# Altium schematic sheet [06] - CPU - HDMI, LVDS.SchDoc
size A2; DocumentNumber: 6; SheetNumber: 6; SheetTotal: 20
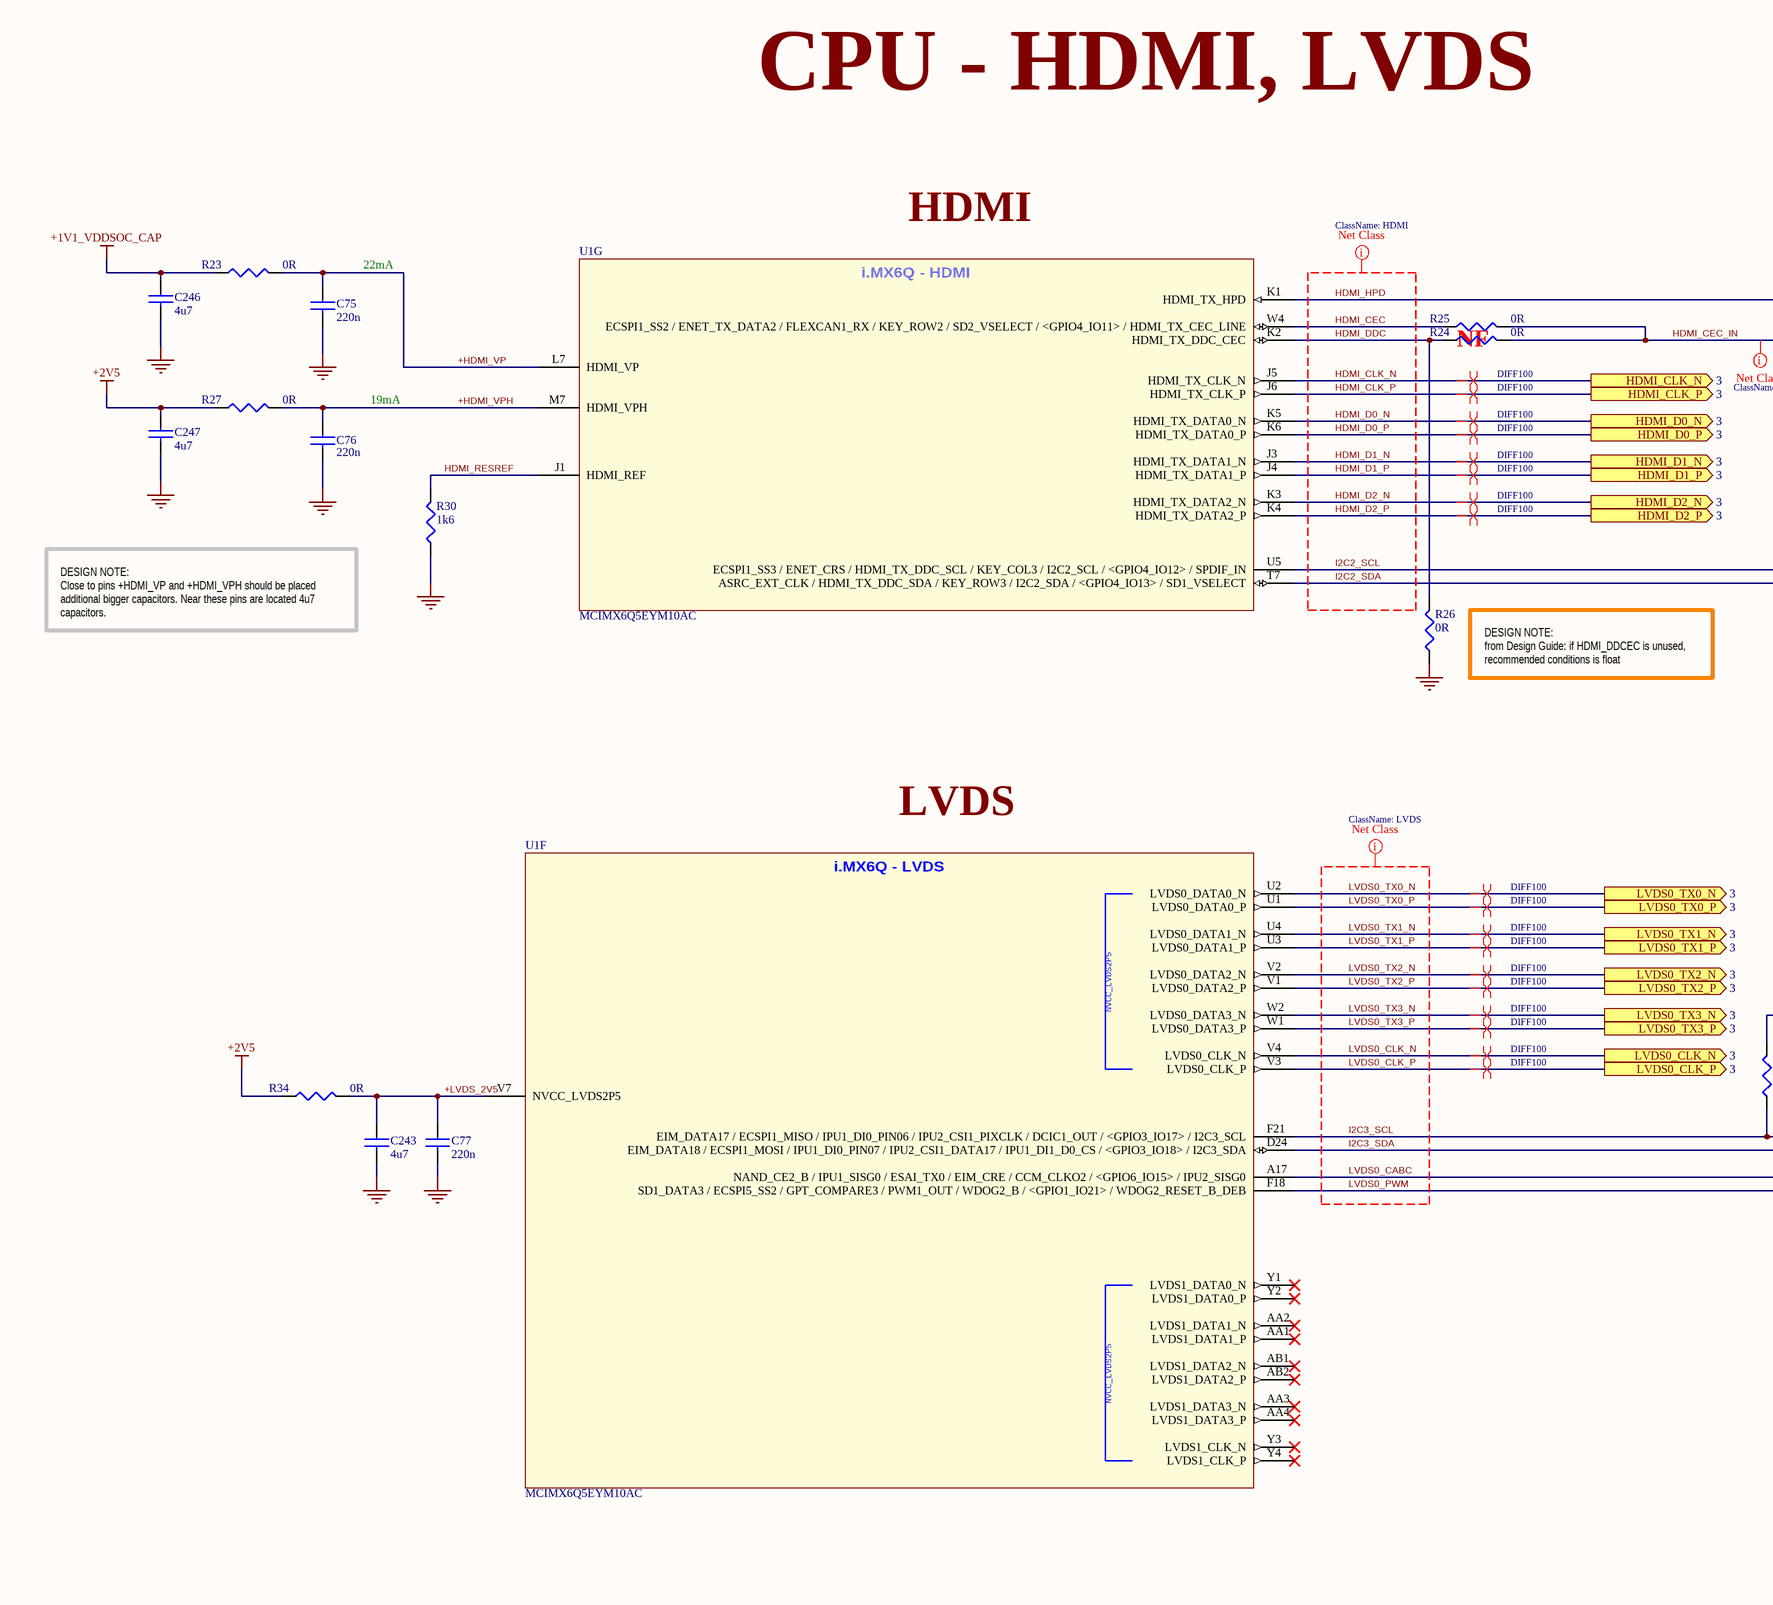
[diagram p0: [06] - CPU - HDMI, LVDS.SchDoc, left]
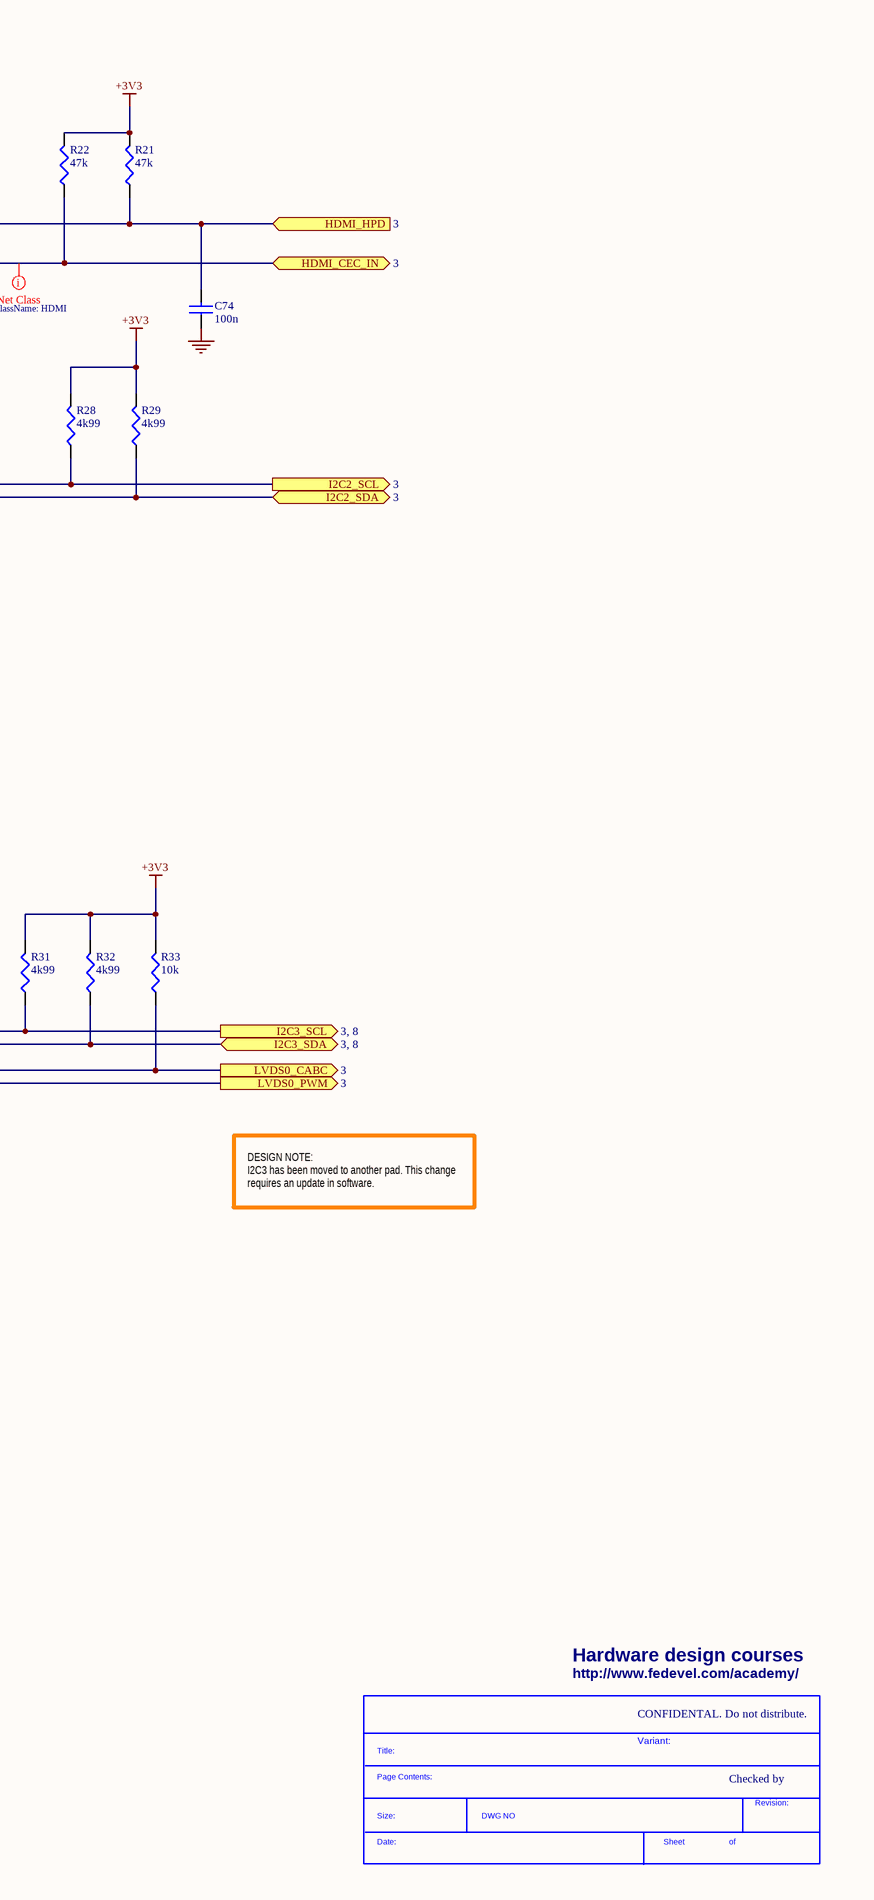
[diagram p1: [06] - CPU - HDMI, LVDS.SchDoc, right]

## Parts
*  SDTitleBlock  (value not drawn)  (graphical)
C74  100n  [C0402]
C75  220n  [C0402]
C76  220n  [C0402]
C77  220n  [C0402]
C243  4u7  [C0402]
C246  4u7  [C0402]
C247  4u7  [C0402]
R21  47k  [R0402]
R22  47k  [R0402]
R23  0R  [R0402]
R24  0R  [R0402]
R25  0R  [R0402]
R26  0R  [R0402]
R27  0R  [R0402]
R28  4k99  [R0402]
R29  4k99  [R0402]
R30  1k6  [R0402]
R31  4k99  [R0402]
R32  4k99  [R0402]
R33  10k  [R0402]
R34  0R  [R0402]
U1  MCIMX6Q5EYM10AC  [PBGA624]  (parts F,G of 15)

## Ports
HDMI_CEC_IN (bidir, see 3), HDMI_CLK_N (out, see 3), HDMI_CLK_P (out, see 3), HDMI_D0_N (out, see 3), HDMI_D0_P (out, see 3), HDMI_D1_N (out, see 3), HDMI_D1_P (out, see 3), HDMI_D2_N (out, see 3), HDMI_D2_P (out, see 3), HDMI_HPD (in, see 3), I2C2_SCL (out, see 3), I2C2_SDA (bidir, see 3), I2C3_SCL (see 3, 8), I2C3_SDA (bidir, see 3, 8), LVDS0_CABC (out, see 3), LVDS0_CLK_N (out, see 3), LVDS0_CLK_P (out, see 3), LVDS0_PWM (out, see 3), LVDS0_TX0_N (out, see 3), LVDS0_TX0_P (out, see 3), LVDS0_TX1_N (out, see 3), LVDS0_TX1_P (out, see 3), LVDS0_TX2_N (out, see 3), LVDS0_TX2_P (out, see 3), LVDS0_TX3_N (out, see 3), LVDS0_TX3_P (out, see 3)

## Nets
+1V1_VDDSOC_CAP: C246.1 R23.1
+2V5: C247.1 R27.1 R34.1
+3V3: R21.2 R22.2 R28.2 R29.2 R31.2 R32.2 R33.2
GND: C74.1 C75.2 C76.2 C77.2 C243.2 C246.2 C247.2 R26.1 R30.1
+HDMI_VP: C75.1 R23.2 U1.L7(HDMI_VP)
+HDMI_VPH: C76.1 R27.2 U1.M7(HDMI_VPH)
+LVDS_2V5: C77.1 C243.1 R34.2 U1.V7(NVCC_LVDS2P5)
HDMI_CEC: R25.1 U1.W4(ECSPI1_SS2_/_ENET_TX_DATA2_/_FLEXCAN1_RX_/_KEY_ROW2_/_SD2_VSELECT_/_<GPIO4_IO11>_/_HDMI_TX_CEC_LINE)
HDMI_CEC_IN: R22.1 R24.2 R25.2 ; port HDMI_CEC_IN
HDMI_CLK_N: U1.J5(HDMI_TX_CLK_N) ; port HDMI_CLK_N
HDMI_CLK_P: U1.J6(HDMI_TX_CLK_P) ; port HDMI_CLK_P
HDMI_D0_N: U1.K5(HDMI_TX_DATA0_N) ; port HDMI_D0_N
HDMI_D0_P: U1.K6(HDMI_TX_DATA0_P) ; port HDMI_D0_P
HDMI_D1_N: U1.J3(HDMI_TX_DATA1_N) ; port HDMI_D1_N
HDMI_D1_P: U1.J4(HDMI_TX_DATA1_P) ; port HDMI_D1_P
HDMI_D2_N: U1.K3(HDMI_TX_DATA2_N) ; port HDMI_D2_N
HDMI_D2_P: U1.K4(HDMI_TX_DATA2_P) ; port HDMI_D2_P
HDMI_DDC: R24.1 R26.2 U1.K2(HDMI_TX_DDC_CEC)
HDMI_HPD: C74.2 R21.1 U1.K1(HDMI_TX_HPD) ; port HDMI_HPD
HDMI_RESREF: R30.2 U1.J1(HDMI_REF)
I2C2_SCL: R28.1 U1.U5(ECSPI1_SS3_/_ENET_CRS_/_HDMI_TX_DDC_SCL_/_KEY_COL3_/_I2C2_SCL_/_<GPIO4_IO12>_/_SPDIF_IN) ; port I2C2_SCL
I2C2_SDA: R29.1 U1.T7(ASRC_EXT_CLK_/_HDMI_TX_DDC_SDA_/_KEY_ROW3_/_I2C2_SDA_/_<GPIO4_IO13>_/_SD1_VSELECT) ; port I2C2_SDA
I2C3_SCL: R31.1 U1.F21(EIM_DATA17_/_ECSPI1_MISO_/_IPU1_DI0_PIN06_/_IPU2_CSI1_PIXCLK_/_DCIC1_OUT_/_<GPIO3_IO17>_/_I2C3_SCL) ; port I2C3_SCL
I2C3_SDA: R32.1 U1.D24(EIM_DATA18_/_ECSPI1_MOSI_/_IPU1_DI0_PIN07_/_IPU2_CSI1_DATA17_/_IPU1_DI1_D0_CS_/_<GPIO3_IO18>_/_I2C3_SDA) ; port I2C3_SDA
LVDS0_CABC: R33.1 U1.A17(NAND_CE2_B_/_IPU1_SISG0_/_ESAI_TX0_/_EIM_CRE_/_CCM_CLKO2_/_<GPIO6_IO15>_/_IPU2_SISG0) ; port LVDS0_CABC
LVDS0_CLK_N: U1.V4(LVDS0_CLK_N) ; port LVDS0_CLK_N
LVDS0_CLK_P: U1.V3(LVDS0_CLK_P) ; port LVDS0_CLK_P
LVDS0_PWM: U1.F18(SD1_DATA3_/_ECSPI5_SS2_/_GPT_COMPARE3_/_PWM1_OUT_/_WDOG2_B_/_<GPIO1_IO21>_/_WDOG2_RESET_B_DEB) ; port LVDS0_PWM
LVDS0_TX0_N: U1.U2(LVDS0_DATA0_N) ; port LVDS0_TX0_N
LVDS0_TX0_P: U1.U1(LVDS0_DATA0_P) ; port LVDS0_TX0_P
LVDS0_TX1_N: U1.U4(LVDS0_DATA1_N) ; port LVDS0_TX1_N
LVDS0_TX1_P: U1.U3(LVDS0_DATA1_P) ; port LVDS0_TX1_P
LVDS0_TX2_N: U1.V2(LVDS0_DATA2_N) ; port LVDS0_TX2_N
LVDS0_TX2_P: U1.V1(LVDS0_DATA2_P) ; port LVDS0_TX2_P
LVDS0_TX3_N: U1.W2(LVDS0_DATA3_N) ; port LVDS0_TX3_N
LVDS0_TX3_P: U1.W1(LVDS0_DATA3_P) ; port LVDS0_TX3_P

Not connected (* = marked no-connect by the designer): U1 AA1(LVDS1_DATA1_P)* AA2(LVDS1_DATA1_N)* AA3(LVDS1_DATA3_N)* AA4(LVDS1_DATA3_P)* AB1(LVDS1_DATA2_N)* AB2(LVDS1_DATA2_P)* Y1(LVDS1_DATA0_N)* Y2(LVDS1_DATA0_P)* Y3(LVDS1_CLK_N)* Y4(LVDS1_CLK_P)*

## Layout directives
differential pair; net class DIFF100: HDMI_CLK_N, HDMI_CLK_P, HDMI_D0_N, HDMI_D0_P, HDMI_D1_N, HDMI_D1_P, HDMI_D2_N, HDMI_D2_P, LVDS0_CLK_N, LVDS0_CLK_P, LVDS0_TX0_N, LVDS0_TX0_P, LVDS0_TX1_N, LVDS0_TX1_P, LVDS0_TX2_N, LVDS0_TX2_P, LVDS0_TX3_N, LVDS0_TX3_P
net class LVDS: I2C3_SCL, I2C3_SDA, LVDS0_CABC, LVDS0_CLK_N, LVDS0_CLK_P, LVDS0_PWM, LVDS0_TX0_N, LVDS0_TX0_P, LVDS0_TX1_N, LVDS0_TX1_P, LVDS0_TX2_N, LVDS0_TX2_P, LVDS0_TX3_N, LVDS0_TX3_P
net class HDMI: HDMI_CEC, HDMI_CEC_IN, HDMI_CLK_N, HDMI_CLK_P, HDMI_D0_N, HDMI_D0_P, HDMI_D1_N, HDMI_D1_P, HDMI_D2_N, HDMI_D2_P, HDMI_DDC, HDMI_HPD, I2C2_SCL, I2C2_SDA

## Notes on the sheet
- CPU - HDMI, LVDS
- HDMI
- (near C75) 22mA
- NF
- 19mA
- DESIGN NOTE:
  Close to pins +HDMI_VP and +HDMI_VPH should be placed additional bigger capacitors. Near these pins are located 4u7 capacitors.
- DESIGN NOTE:
  from Design Guide: if HDMI_DDCEC is unused, recommended conditions is float
- LVDS
- DESIGN NOTE:
  I2C3 has been moved to another pad. This change requires an update in software.
- Hardware design courses
- http://www.fedevel.com/academy/
- CONFIDENTAL. Do not distribute.
- Variant:
- Checked by
- (in symbol MCIMX6Q5EYM10AC, part F) i.MX6Q - LVDS
- (in symbol MCIMX6Q5EYM10AC, part G) i.MX6Q - HDMI
- (in symbol SDTitleBlock) Title:; Page Contents:; Revision:; Size:; DWG NO; Date:; Sheet; of

## Library data of the parts
C74 = C1005X5R1H104K: CAP CER .10UF 50V X5R 10% 0402; Manufacturer: TDK Corporation; Capacitance: 0.1µF; Value: 100nF; .Checked PCB: used; Description: CAP CER 0.1UF 50V 10% X5R 0402; Category: Capacitors; Supplier Part Number: 445-5942-1-ND; Manufacturer Part Number: C1005X5R1H104K; Operating Temperature: -55°C ~ 85°C; Package / Case: 0402 (1005 Metric); Price 1k [$]: 0.02340; .Checked SCH: used; Voltage - Rated: 50V; Supplier: Digikey; Supplier 1: Digi-Key; Supplier Part Number 1: 445-5942-1-ND; RoHS: RoHS Compliant; Stock 1: 106926; Pricing 1: 1=0.27, 10=0.18, 100=0.072, 250=0.05176, 500=0.0369, 1000=0.027 (USD); Tolerance: ±10%; Temperature Coefficient: X5R; Mounting Type: Surface Mount, MLCC; Applications: General Purpose; Ratings: -; Size / Dimension: 0.039" L x 0.020" W (1.00mm x 0.50mm); Height - Seated (Max): -; Thickness (Max): 0.022" (0.55mm); Lead Spacing: -; Features: -; Packaging: Cut Tape (CT); Lead Style: -; ComponentLink1URL: http://www.tdk.co.jp/tefe02/e412_c.pdf; ComponentLink1Description: http://www.tdk.co.jp/tefe02/e412_c.pdf
C75-C77 = C1005X5R1E224M: CAP CER .22UF 25V X5R 20% 0402; Manufacturer: TDK Corporation; Capacitance: 0.22µF; Value: 220nF; .Checked PCB: used; Description: CAP CER 0.22UF 25V 20% X5R 0402; Category: Capacitors; Supplier Part Number: 445-5945-1-ND; Manufacturer Part Number: C1005X5R1E224M; Operating Temperature: -55°C ~ 85°C; Package / Case: 0402 (1005 Metric); Price 1k [$]: 0.02600; .Checked SCH: used; Voltage - Rated: 25V; Supplier: Digikey; Supplier 1: Digi-Key; Supplier Part Number 1: 445-5945-1-ND; RoHS: RoHS Compliant; Stock 1: 54593; Pricing 1: 1=0.3, 10=0.2, 100=0.08, 250=0.05752, 500=0.041, 1000=0.03 (USD); Tolerance: ±20%; Temperature Coefficient: X5R; Mounting Type: Surface Mount, MLCC; Applications: General Purpose; Ratings: -; Size / Dimension: 0.039" L x 0.020" W (1.00mm x 0.50mm); Height - Seated (Max): -; Thickness (Max): 0.022" (0.55mm); Lead Spacing: -; Features: -; Packaging: Cut Tape (CT); Lead Style: -; ComponentLink1URL: http://www.tdk.co.jp/tefe02/e412_c.pdf; ComponentLink1Description: http://www.tdk.co.jp/tefe02/e412_c.pdf
C243 C246 C247 = C1005X5R1A475M: CAP CER 4.7UF 10V 20% X5R 0402; Manufacturer: TDK Corporation; Capacitance: 4.7µF; .Checked PCB: RF; Supplier 1: Digi-Key; Supplier Part Number 1: 445-8023-1-ND; Manufacturer Part Number: C1005X5R1A475M; RoHS: RoHS Compliant; Category: Capacitors; Stock 1: 10140; Pricing 1: 1=0.53, 10=0.415, 100=0.25, 250=0.18752, 500=0.16, 1000=0.125, 5000=0.095 (USD); Voltage - Rated: 10V; Tolerance: ±20%; Temperature Coefficient: X5R; Mounting Type: Surface Mount, MLCC; Operating Temperature: -55°C ~ 85°C; Applications: General Purpose; Ratings: -; Package / Case: 0402 (1005 Metric); Size / Dimension: 0.039" L x 0.020" W (1.00mm x 0.50mm); Height - Seated (Max): -; Thickness (Max): -; Lead Spacing: -; Features: -; Packaging: Cut Tape (CT); Lead Style: -; ComponentLink1URL: http://www.tdk.com/pdf/general_B11.pdf; ComponentLink1Description: http://www.tdk.com/pdf/general_B11.pdf; .Checked SCH: RF
R21 R22 = RC0402FR-0747KL: RES 47.0K OHM 1/16W 1% 0402 SMD; Manufacturer: Yageo; Power (Watts): 0.063W, 1/16W; .Checked PCB: used; Temperature Coefficient: ±100ppm/°C; Category: Resistors; Supplier Part Number: 311-47.0KLRCT-ND; Manufacturer Part Number: RC0402FR-0747KL; Package / Case: 0402 (1005 Metric); Price 1k [$]: 0.01421; Resistance (Ohms): 47K; Tolerance: ±1%; Value: 47k; .Checked SCH: used; Supplier: Digikey; Supplier 1: Digi-Key; Supplier Part Number 1: 311-47.0KLRCT-ND; RoHS: RoHS Compliant; Stock 1: 1227580; Pricing 1: 10=0.014, 50=0.0104, 100=0.0079, 250=0.00584, 500=0.00432, 1000=0.00288 (USD); Composition: Thick Film; Features: -; Size / Dimension: 0.039" L x 0.020" W (1.00mm x 0.50mm); Height: 0.016" (0.40mm); Number of Terminations: 2; Packaging: Cut Tape (CT); ComponentLink1URL: http://www.yageo.com/documents/recent/PYu-RC0402_51_RoHS_L_6.pdf; ComponentLink1Description: http://www.yageo.com/documents/recent/PYu-RC0402_51_RoHS_L_6.pdf
R23-R27 R34 = RC0402JR-070RL: RES 0.0 OHM 1/16W 0402 SMD; Manufacturer: Yageo; Resistance (Ohms): 0.0; Power (Watts): 0.063W, 1/16W; Tolerance: Jumper; .Checked PCB: used; Category: Resistors; Supplier Part Number: 311-0.0JRCT-ND; Manufacturer Part Number: RC0402JR-070RL; Package / Case: 0402 (1005 Metric); Price 1k [$]: 0.01389; Value: 0R; .Checked SCH: used; Supplier: Digikey; Supplier 1: Digi-Key; Supplier Part Number 1: 311-0.0JRCT-ND; RoHS: RoHS Compliant; Stock 1: 1106330; Pricing 1: 10=0.012, 50=0.009, 100=0.0069, 250=0.00512, 500=0.0038, 1000=0.00253 (USD); Composition: Thick Film; Features: -; Temperature Coefficient: -; Size / Dimension: 0.039" L x 0.020" W (1.00mm x 0.50mm); Height: 0.016" (0.40mm); Number of Terminations: 2; Packaging: Cut Tape (CT); ComponentLink1URL: http://www.yageo.com/documents/recent/PYu-RC0402_51_RoHS_L_6.pdf; ComponentLink1Description: http://www.yageo.com/documents/recent/PYu-RC0402_51_RoHS_L_6.pdf
R28 R29 R31 R32 = RMCF0402FT4K99: RES TF 4.99K OHM 1% 1/16W 0402; Manufacturer: Stackpole Electronics Inc; Power (Watts): 0.063W, 1/16W; .Checked PCB: used; Temperature Coefficient: ±100ppm/°C; Category: Resistors; Supplier Part Number: RMCF0402FT4K99CT-ND; Manufacturer Part Number: RMCF0402FT4K99; Package / Case: 0402 (1005 Metric); Price 1k [$]: 0.00384; Resistance (Ohms): 4.99K; Tolerance: ±1%; Value: 4k99; .Checked SCH: used; Supplier: Digikey; Supplier 1: Digi-Key; Supplier Part Number 1: RMCF0402FT4K99CT-ND; RoHS: RoHS Compliant; Stock 1: 48509; Pricing 1: 1=0.04, 10=0.025, 50=0.0138, 100=0.0105, 250=0.0078, 500=0.00576, 1000=0.00384 (USD); Composition: Thick Film; Features: -; Size / Dimension: 0.039" L x 0.020" W (1.00mm x 0.50mm); Height: 0.016" (0.40mm); Number of Terminations: 2; Packaging: Cut Tape (CT); ComponentLink1URL: http://www.seielect.com/Catalog/SEI-RMCF.pdf; ComponentLink1Description: http://www.seielect.com/Catalog/SEI-RMCF.pdf
R30 = ERJ-2RKF1601X: RES 1.6K OHM 1/10W 1% 0402 SMD; Manufacturer: Panasonic Electronic Components; Power (Watts): 0.1W, 1/10W; Temperature Coefficient: ±100ppm/°C; .Creator: MM; .Checked PCB: RF, used by MM; .Checked SCH: MM, checked by RF; Supplier 1: Digi-Key; Manufacturer Part Number: ERJ-2RKF1601X; RoHS: RoHS Compliant; Category: Resistors; Stock 1: 89488; Pricing 1: 1=0.1, 50=0.0242, 100=0.0184, 250=0.01364, 500=0.01008, 1000=0.00672, 5000=0.00473 (USD); Resistance (Ohms): 1.6k; Composition: Thick Film; Features: -; Tolerance: ±1%; Package / Case: 0402 (1005 Metric); Supplier Device Package: 0402; Size / Dimension: 0.039" L x 0.020" W (1.00mm x 0.50mm); Height: 0.016" (0.40mm); Number of Terminations: 2; Packaging: Cut Tape (CT); ComponentLink1URL: http://industrial.panasonic.com/www-cgi/jvcr13pz.cgi?E+PZ+3+AOA0002+ERJ2RKF1601X+7+WW; ComponentLink1Description: http://industrial.panasonic.com/www-cgi/jvcr13pz.cgi?E+PZ+3+AOA0002+ERJ2RKF1601X+7+WW; Supplier Part Number 1: P1.60KLCT-ND
R33 = RC0402FR-0710KL: RES 10.0K OHM 1/16W 1% 0402 SMD; Manufacturer: Yageo; Power (Watts): 0.063W, 1/16W; .Checked PCB: used; Temperature Coefficient: ±100ppm/°C; Category: Resistors; Supplier Part Number: 311-10.0KLRCT-ND; Manufacturer Part Number: RC0402FR-0710KL; Package / Case: 0402 (1005 Metric); Price 1k [$]: 0.01421; Resistance (Ohms): 10K; Tolerance: ±1%; Value: 10k; .Checked SCH: used; Supplier: Digikey; Supplier 1: Digi-Key; Supplier Part Number 1: 311-10.0KLRCT-ND; RoHS: RoHS Compliant; Stock 1: 2916495; Pricing 1: 10=0.014, 50=0.0104, 100=0.0079, 250=0.00584, 500=0.00432, 1000=0.00288 (USD); Composition: Thick Film; Features: -; Size / Dimension: 0.039" L x 0.020" W (1.00mm x 0.50mm); Height: 0.016" (0.40mm); Number of Terminations: 2; Packaging: Cut Tape (CT); ComponentLink1URL: http://www.yageo.com/documents/recent/PYu-RC0402_51_RoHS_L_6.pdf; ComponentLink1Description: http://www.yageo.com/documents/recent/PYu-RC0402_51_RoHS_L_6.pdf
U1 = MCIMX6Q5EYM10AC: IC MCU 32BIT ARM QUAD 624FCBGA; Manufacturer: Freescale Semiconductor; Core Processor: ARM® Cortex™-A9; Core Size: 32-Bit Quad-Core; Speed: 1.0GHz; Connectivity: CAN, EBI/EMI, ESAI, Ethernet, GPMI, I2C, MMC/SD, PCI, SATA, SPI, UART, USB, USB OTG; Peripherals: DMA, HDMI, I2S/SSI/AC97, MIPI CSI, MIMI DSI, MIPI HIS, PWM, WDT; Number of I /O: 224; Program Memory Type: External Program Memory; RAM Size: 256K x 8; Voltage - Supply (Vcc/Vdd): 0.925 V ~ 1.5 V; Oscillator Type: Internal; .Creator: MM; .Checked PCB: MM, checked by RF; Supplier 1: Digi-Key; Manufacturer Part Number: MCIMX6Q5EYM10AC; RoHS: RoHS Compliant; Category: Integrated Circuits (ICs); Stock 1: 0; Pricing 1: 1=54.98, 10=51.922, 25=48.868, 100=30.5424 (USD); Program Memory Size: -; EEPROM Size: -; Data Converters: -; Operating Temperature: -20°C ~ 105°C; Package / Case: 624-FBGA, FCBGA; Packaging: Tray; ComponentLink1URL: http://cache.freescale.com/files/32bit/doc/data_sheet/IMX6DQCEC.pdf; ComponentLink1Description: http://cache.freescale.com/files/32bit/doc/data_sheet/IMX6DQCEC.pdf; Supplier Part Number 1: MCIMX6Q5EYM10AC-ND; .Checked SCH: MM